# Altium schematic sheet STM32.SchDoc
size 431 x 279 mm; SheetNumber: 2; SheetTotal: 4
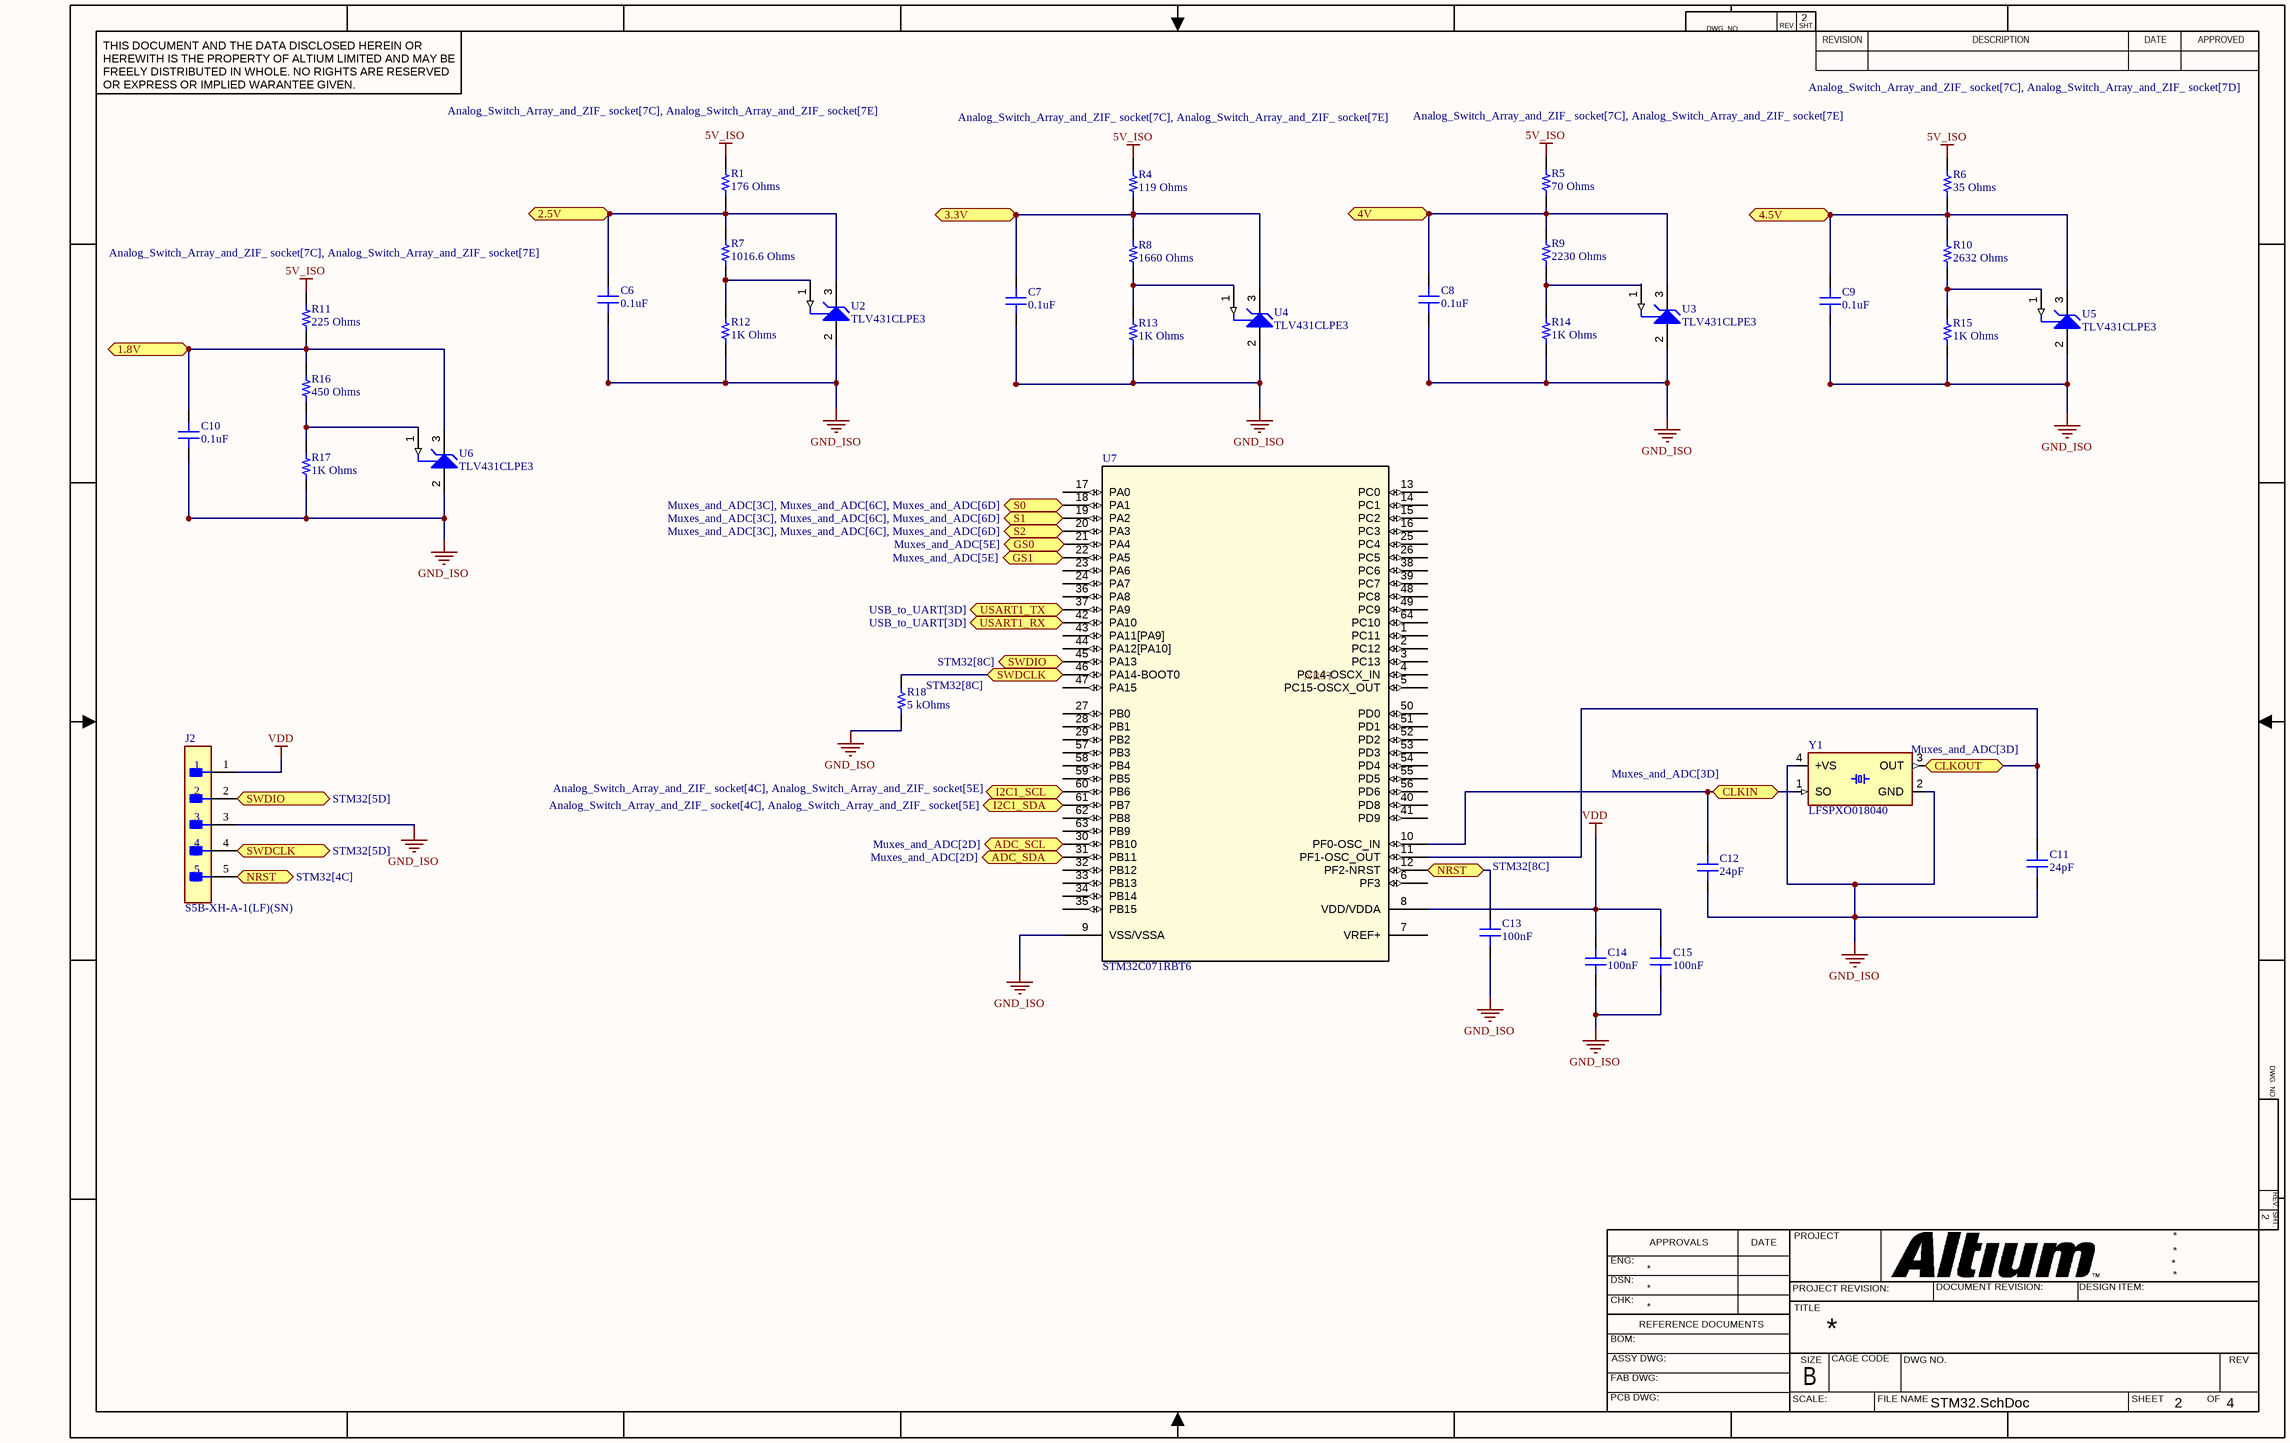
[diagram p0: STM32.SchDoc]

## Parts
C6  value 0.1uF  [MURATA GRM155 0402_1005]  (hidden comment: GRM155R71H104KE14D)
C7  value 0.1uF  [MURATA GRM155 0402_1005]  (hidden comment: GRM155R71H104KE14D)
C8  value 0.1uF  [MURATA GRM155 0402_1005]  (hidden comment: GRM155R71H104KE14D)
C9  value 0.1uF  [MURATA GRM155 0402_1005]  (hidden comment: GRM155R71H104KE14D)
C10  value 0.1uF  [MURATA GRM155 0402_1005]  (hidden comment: GRM155R71H104KE14D)
C11  value 24pF  [MURATA GRM155 0402_1005]  (hidden comment: GRM155R71H104KE14D)
C12  value 24pF  [MURATA GRM155 0402_1005]  (hidden comment: GRM155R71H104KE14D)
C13  value 100nF  [MURATA GRM155 0402_1005]  (hidden comment: GRM155R71H104KE14D)
C14  value 100nF  [MURATA GRM155 0402_1005]  (hidden comment: GRM155R71H104KE14D)
C15  value 100nF  [MURATA GRM155 0402_1005]  (hidden comment: GRM155R71H104KE14D)
J2  S5B-XH-A-1(LF)(SN)  [FP-S5B-XH-A-1_LF_SN-MFG]
R1  value 176 Ohms  [RES 0805_2012]  (hidden comment: RMEF0805FT200R)
R4  value 119 Ohms  [RES 0805_2012]  (hidden comment: RMEF0805FT200R)
R5  value 70 Ohms  [RES 0805_2012]  (hidden comment: RMEF0805FT200R)
R6  value 35 Ohms  [RES 0805_2012]  (hidden comment: RMEF0805FT200R)
R7  value 1016.6 Ohms  [RES 0805_2012]  (hidden comment: RMEF0805FT200R)
R8  value 1660 Ohms  [RES 0805_2012]  (hidden comment: RMEF0805FT200R)
R9  value 2230 Ohms  [RES 0805_2012]  (hidden comment: RMEF0805FT200R)
R10  value 2632 Ohms  [RES 0805_2012]  (hidden comment: RMEF0805FT200R)
R11  value 225 Ohms  [RES 0805_2012]  (hidden comment: RMEF0805FT200R)
R12  value 1K Ohms  [RES 0805_2012]  (hidden comment: RMEF0805FT200R)
R13  value 1K Ohms  [RES 0805_2012]  (hidden comment: RMEF0805FT200R)
R14  value 1K Ohms  [RES 0805_2012]  (hidden comment: RMEF0805FT200R)
R15  value 1K Ohms  [RES 0805_2012]  (hidden comment: RMEF0805FT200R)
R16  value 450 Ohms  [RES 0805_2012]  (hidden comment: RMEF0805FT200R)
R17  value 1K Ohms  [RES 0805_2012]  (hidden comment: RMEF0805FT200R)
R18  value 5 kOhms  [RES 0603_1608]  (hidden comment: PNM0603E5001BST5)
U2  TLV431CLPE3  [TI-LP3]
U3  TLV431CLPE3  [TI-LP3]
U4  TLV431CLPE3  [TI-LP3]
U5  TLV431CLPE3  [TI-LP3]
U6  TLV431CLPE3  [TI-LP3]
U7  STM32C071RBT6  [LQFP-64_STM]
Y1  LFSPXO018040  [WE-SPXO_LFSPXO018040]

## Ports
1.8V (bidir, see Analog_Switch_Array_and_ZIF_ socket[7C], Analog_Switch_Array_and_ZIF_ socket[7E]), 2.5V (bidir, see Analog_Switch_Array_and_ZIF_ socket[7C], Analog_Switch_Array_and_ZIF_ socket[7E]), 3.3V (bidir, see Analog_Switch_Array_and_ZIF_ socket[7C], Analog_Switch_Array_and_ZIF_ socket[7E]), 4.5V (bidir, see Analog_Switch_Array_and_ZIF_ socket[7C], Analog_Switch_Array_and_ZIF_ socket[7D]), 4V (bidir, see Analog_Switch_Array_and_ZIF_ socket[7C], Analog_Switch_Array_and_ZIF_ socket[7E]), ADC_SCL (bidir, see Muxes_and_ADC[2D]), ADC_SDA (bidir, see Muxes_and_ADC[2D]), CLKIN (bidir, see Muxes_and_ADC[3D]), CLKOUT (bidir, see Muxes_and_ADC[3D]), GS0 (bidir, see Muxes_and_ADC[5E]), GS1 (bidir, see Muxes_and_ADC[5E]), I2C1_SCL (bidir, see Analog_Switch_Array_and_ZIF_ socket[4C], Analog_Switch_Array_and_ZIF_ socket[5E]), I2C1_SDA (bidir, see Analog_Switch_Array_and_ZIF_ socket[4C], Analog_Switch_Array_and_ZIF_ socket[5E]), NRST (bidir, see STM32[4C]), NRST (bidir, see STM32[8C]), S0 (bidir, see Muxes_and_ADC[3C], Muxes_and_ADC[6C], Muxes_and_ADC[6D]), S1 (bidir, see Muxes_and_ADC[3C], Muxes_and_ADC[6C], Muxes_and_ADC[6D]), S2 (bidir, see Muxes_and_ADC[3C], Muxes_and_ADC[6C], Muxes_and_ADC[6D]), SWDCLK (bidir, see STM32[5D]), SWDCLK (bidir, see STM32[8C]), SWDIO (bidir, see STM32[5D]), SWDIO (bidir, see STM32[8C]), USART1_RX (bidir, see USB_to_UART[3D]), USART1_TX (bidir, see USB_to_UART[3D])

## Nets
5V_ISO: R1.1 R4.1 R5.1 R6.1 R11.1
GND_ISO: C6.1 C7.1 C8.1 C9.1 C10.1 C11.1 C12.1 C13.1 C14.1 C15.1 J2.3 R12.1 R13.1 R14.1 R15.1 R17.1 R18.1 U2.2(ANODE) U3.2(ANODE) U4.2(ANODE) U5.2(ANODE) U6.2(ANODE) U7.9(VSS/VSSA) Y1.2(GND) Y1.4(+VS)
VDD: C14.2 C15.2 J2.1 U7.8(VDD/VDDA)
1.8V: C10.2 R11.2 R16.2 U6.3(CATHODE) ; port 1.8V
2.5V: C6.2 R1.2 R7.2 U2.3(CATHODE) ; port 2.5V
3.3V: C7.2 R4.2 R8.2 U4.3(CATHODE) ; port 3.3V
4.5V: C9.2 R6.2 R10.2 U5.3(CATHODE) ; port 4.5V
4V: C8.2 R5.2 R9.2 U3.3(CATHODE) ; port 4V
ADC_SCL: U7.30(PB10) ; port ADC_SCL
ADC_SDA: U7.31(PB11) ; port ADC_SDA
CLKIN: C12.2 U7.10(PF0-OSC_IN) Y1.1(SO) ; port CLKIN
CLKOUT: C11.2 U7.11(PF1-OSC_OUT) Y1.3(OUT) ; port CLKOUT
GS1: U7.22(PA5) ; port GS1
I2C1_SCL: U7.60(PB6) ; port I2C1_SCL
I2C1_SDA: U7.61(PB7) ; port I2C1_SDA
NRST: C13.2 J2.5 U7.12(PF2-NRST) ; port NRST
S0: U7.18(PA1) ; port S0
S1: U7.19(PA2) ; port S1
S2: U7.20(PA3) ; port S2
SWDCLK: J2.4 R18.2 U7.46(PA14-BOOT0) ; port SWDCLK
SWDIO: J2.2 U7.45(PA13) ; port SWDIO
USART1_RX: U7.42(PA10) ; port USART1_RX
USART1_TX: U7.37(PA9) ; port USART1_TX
NetR7_1: R7.1 R12.2 U2.1(REF)
NetR8_1: R8.1 R13.2 U4.1(REF)
NetR9_1: R9.1 R14.2 U3.1(REF)
NetR10_1: R10.1 R15.2 U5.1(REF)
NetR16_1: R16.1 R17.2 U6.1(REF)

Not connected (* = marked no-connect by the designer): U7 1(PC11) 2(PC12) 3(PC13) 4(PC14-OSCX_IN) 5(PC15-OSCX_OUT) 6(PF3) 7(VREF+) 13(PC0) 14(PC1) 15(PC2) 16(PC3) 17(PA0) 21(PA4) 23(PA6) 24(PA7) 25(PC4) 26(PC5) 27(PB0) 28(PB1) 29(PB2) 32(PB12) 33(PB13) 34(PB14) 35(PB15) 36(PA8) 38(PC6) 39(PC7) 40(PD8) 41(PD9) 43(PA11[PA9]) 44(PA12[PA10]) 47(PA15) 48(PC8) 49(PC9) 50(PD0) 51(PD1) 52(PD2) 53(PD3) 54(PD4) 55(PD5) 56(PD6) 57(PB3) 58(PB4) 59(PB5) 62(PB8) 63(PB9) 64(PC10)

## Notes on the sheet
- Labels drawn without touching a wire or pin: NRST
- DWG. NO.
- REV.
- SHT.
- THIS DOCUMENT AND THE DATA DISCLOSED HEREIN OR HEREWITH IS THE PROPERTY OF ALTIUM LIMITED AND MAY BE FREELY DISTRIBUTED IN WHOLE. NO RIGHTS ARE RESERVED OR EXPRESS OR IMPLIED WARANTEE GIVEN.
- REVISION
- DESCRIPTION
- DATE
- APPROVED
- ENG:
- APPROVALS
- PROJECT
- DSN:
- CHK:
- REFERENCE DOCUMENTS
- PROJECT REVISION:
- TITLE
- DOCUMENT REVISION:
- DESIGN ITEM:
- BOM:
- FAB DWG:
- PCB DWG:
- ASSY DWG:
- SCALE:
- SIZE
- B
- CAGE CODE
- FILE NAME
- DWG NO.
- SHEET
- OF
- REV

## Library data of the parts
C6-C15 = CMP-001-031367-1: CAP CER 0.1UF 50V X7R 0402; Part Number: GRM155R71H104KE14D
J2 = CMP-17439-000362-1: CONN HEADER R/A 5POS 2.5MM; Number of Positions: 5; Voltage Rating: 250V; Contact Shape: Square; Number of Rows: 1; Lead Free: Lead Free; Contact Material: Brass; Termination: Press-Fit; Connector Type: Header; Contact Finish - Mating: TIN; Insulation Color: Natural; Packaging: Bulk; Min Operating Temperature: -25°C; Series: XH; Mount: Through Hole; Contact Type: Male Pin; Insulation Material: Nylon; Max Operating Temperature: 85°C; Pitch: 2.5mm; Fastening Type: Detent; Flammability Rating: UL94 V-0
R1 R4-R17 = CMP-009-068802-1: RES 200 OHM 1% 1/8W 0805; Part Number: RMEF0805FT200R
R18 = CMP-009-033475-1: RES SMD 5K OHM 0.1% 0.15W 0603; Part Number: PNM0603E5001BST5
U2-U6 = CMP-0366-00210-1: Low Voltage Adjustable Precision Shunt Regulator, 39 ppm / degC, 15 mA, 0 to 70 degC, 3-pin TO-92 (LP), Pb-Free (RoHS); Manufacturer: Texas Instruments; Eco-Plan: Green (RoHS & no Sb/Br); Iout/Iz(Max)(mA): 15; VO Adj(Max)(V): 6; Min Iz for Regulation(uA): 80; SubFamily: Shunt Voltage Reference; VO Adj(Min)(V): 1.24; Rating: Catalog; Temp Coeff(Typ)(ppm/ degree C): 39; Initial Accuracy @ 25/deg C(%): 1.5; Temp Coeff(Max)(ppm/ degree C): 129; PackageReference: LP3; PackageDescription: Plastic Cylindrical Package, Formed Lead Option (TO-92); ComponentLink2URL: http://www.ti.com/general/docs/lit/getliterature.tsp?genericPartNumber=TLV431&fileType=pdf; ComponentLink2Description: Datasheet; ComponentLink3Description: Package Specification; ComponentLink1URL: http://www.ti.com/; PartNumber: TLV431CLPE3; PackageVersion: 4040001-2/C; Code_JEDEC: TO-226; ComponentLink3URL: http://www.ti.com/litv/pdf/msot002a; DatasheetVersion: SLVS139T; ComponentLink1Description: Manufacturer URL; Mounting Technology: Through Hole
U7 = CMP-031-00033-1: Mainstream Arm Cortex-M0+ MCU with 128 Kbytes of Flash memory, 24 Kbytes RAM, 48 MHz CPU, 2x USART, timers, ADC, comm. I/F, USB FS, 2-3.6V; Manufacturer_Name: STMicroelectronics; Copyright: Copyright (C) 2025 Ultra Librarian. All rights reserved.; Component Type: Standard; Pins: 64; Source: STM32C071RBT6.SchLib; Type: Type; RefDes: RefDes; Manufacturer_Part_Number: STM32C071RBT6; Design Item ID: STM32C071RBT6
Y1 = CMP-574-000000-1: MF: IQD Frequency Products; MP: LFSPXO018040; Availability: Available; Component Type: Standard; Pin Count: 4; Package: 4-SMD, No Lead; Source: LFSPXO018040.SchLib; Design Item ID: LFSPXO018040; Value: *; Price: $1.72